# Altium schematic sheet IDD_measurement.SchDoc: IDD_measurement
size A3; DocumentNumber: MB1144; Revision: C-02; SheetNumber: 19; SheetTotal: 25; Project: STM32L476G-EVAL; ModifiedDate: 9/23/2015
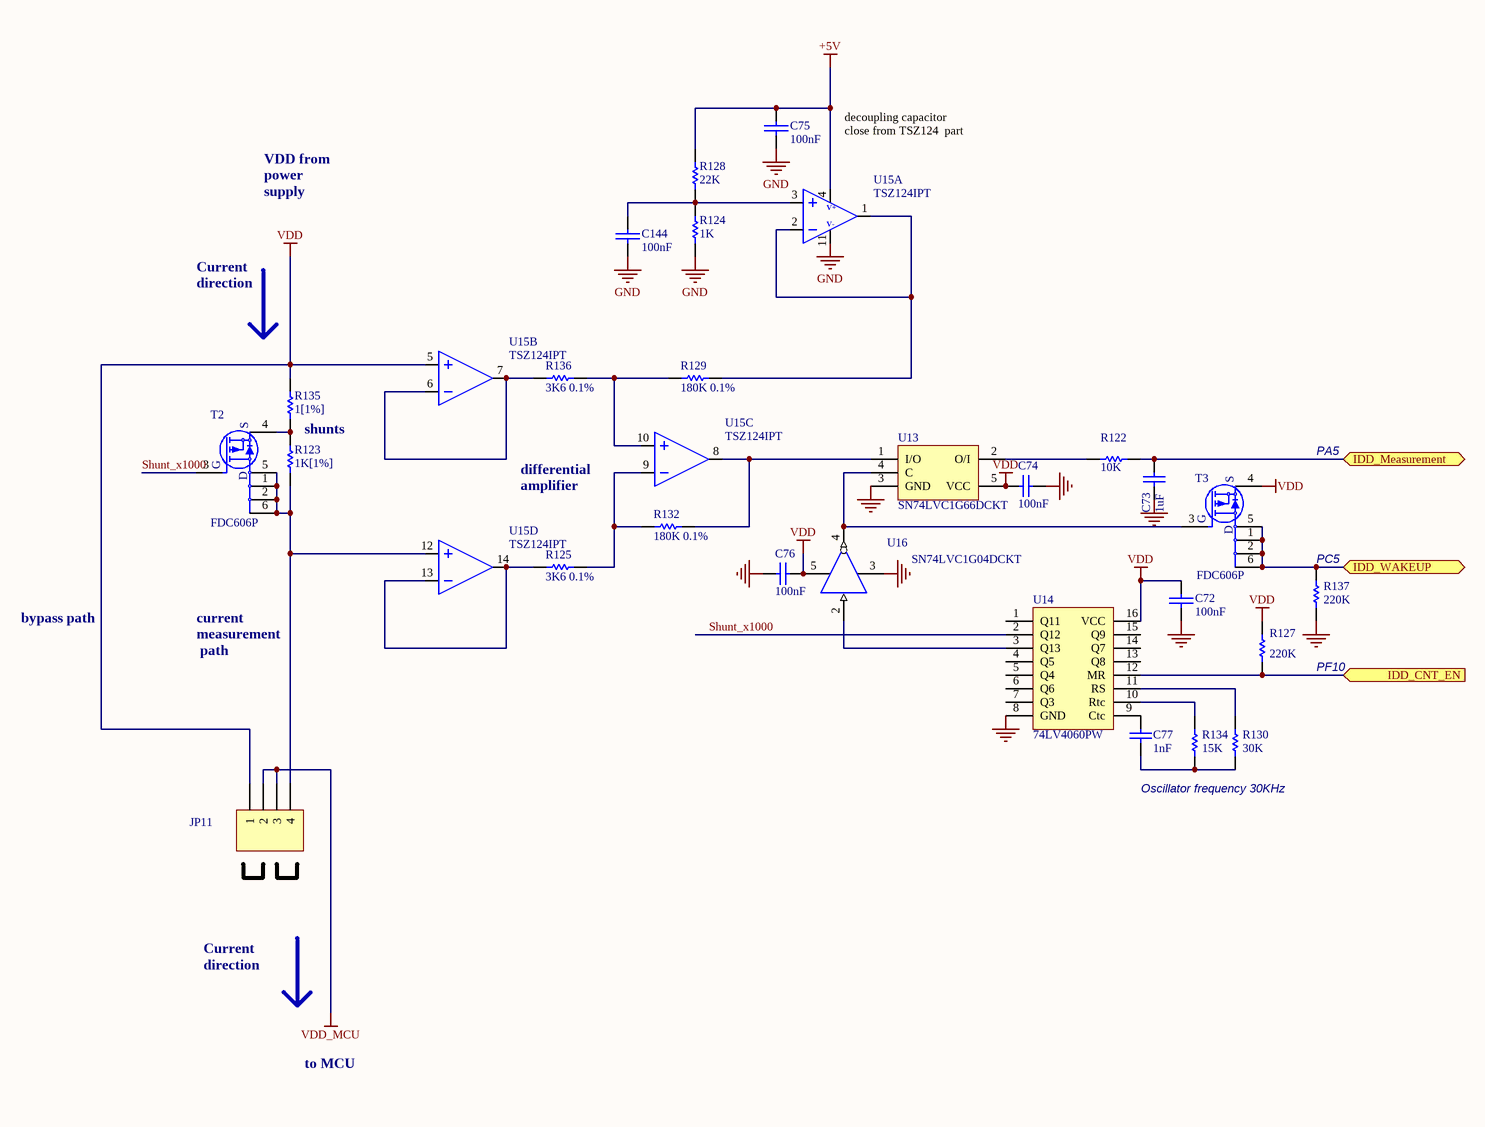
[diagram p0: IDD_measurement.SchDoc]

## Parts
C72  100nF  [0402C]
C73  1uF  [0603C]
C74  100nF  [0402C]
C75  100nF  [0402C]
C76  100nF  [0402C]
C77  1nF  [0402C]
C144  100nF  [0402C]
JP11  Header 4  [SIP4]  (value not drawn)
R122  10K  [0402R]
R123  1K[1%]  [0603R]
R124  1K  [0402R]
R125  3K6 0.1%  [0402R]
R127  220K  [0402R]
R128  22K  [0402R]
R129  180K 0.1%  [0402R]
R130  30K  [0402R]
R132  180K 0.1%  [0402R]
R134  15K  [0402R]
R135  1[1%]  [0603R]
R136  3K6 0.1%  [0402R]
R137  220K  [0402R]
T2  FDC606P  [SOT23-6]
T3  FDC606P  [SOT23-6]
U13  SN74LVC1G66DCKT  [SC70-5]
U14  74LV4060PW  [TSSOP16_0R65_5x6R4]
U15  TSZ124IPT  [TSSOP14_0R65_5X6R4]  (parts A,B,C,D of 4)
U16  SN74LVC1G04DCKT  [SC70-5]

## Ports
IDD_CNT_EN (in), IDD_Measurement, IDD_WAKEUP

## Nets
+5V: C75.1 R128.1 U15.4
GND: C72.2 C73.2 C74.1 C75.2 C76.2 C144.2 R124.2 R137.2 U13.3(GND) U14.8(GND) U15.11 U16.3(GND)
VDD: C72.1 C74.2 C76.1 JP11.1 R127.1 R135.2 T3.4(S) U13.5(VCC) U14.16(VCC) U15.5 U16.5(VCC)
VDD_MCU: JP11.2 JP11.3
IDD_CNT_EN: R127.2 U14.12(MR) ; port IDD_CNT_EN
IDD_Measurement: C73.1 R122.2 ; port IDD_Measurement
IDD_WAKEUP: R137.1 T3.1(D) T3.2(D) T3.5(D) T3.6(D) ; port IDD_WAKEUP
Shunt_x1000: T2.3(G) U14.2(Q12)
NetC77_1: C77.1 U14.9(Ctc)
NetC77_2: C77.2 R130.2 R134.2
NetC144_1: C144.1 R124.1 R128.2 U15.3
NetJP11_4: JP11.4 R123.1 T2.1(D) T2.2(D) T2.5(D) T2.6(D) U15.12
NetR122_1: R122.1 U13.2(O/I)
NetR123_2: R123.2 R135.1 T2.4(S)
NetR125_1: R125.1 U15.13 U15.14
NetR125_2: R125.2 R132.1 U15.9
NetR129_1: R129.1 R136.2 U15.10
NetR129_2: R129.2 U15.1 U15.2
NetR130_1: R130.1 U14.11(RS)
NetR132_2: R132.2 U13.1(I/O) U15.8
NetR134_1: R134.1 U14.10(Rtc)
NetR136_1: R136.1 U15.6 U15.7
NetT3_3: T3.3(G) U13.4(C) U16.4(1Y)
NetU14_3: U14.3(Q13) U16.2(1A)

Not connected (* = marked no-connect by the designer): U14 1(Q11) 4(Q5) 5(Q4) 6(Q6) 7(Q3) 13(Q8) 14(Q7) 15(Q9); U16 1(NC)

## Notes on the sheet
- decoupling capacitor
  close from TSZ124  part
- VDD from power supply
- Current direction
- shunts
- PA5
- differential
  amplifier
- (near R137) PC5
- bypass path
- current
  measurement
  path
- PF10
- Oscillator frequency 30KHz
- to MCU
- Title:
- Project:
- Size:
- Date:
- A3
- Reference:
- Sheet:
- Revision:
- of
- (in symbol AOP-14PINS, part A) V+; V-

## Library data of the parts
C72 C75 C144 = CAP: Ordered by: Subcon; ECCN_US/EU: NA
C73 = CAP: Capacitor; Value: 100nF; Ordered by: Subcon; ECCN_US/EU: NA; Published: 8-Jun-2000; Revision: July-2002: Re-released for DXP Platform.; Publisher: Altium Limited
C74 C76 = CAP: Capacitor; Value: 100pF; Ordered by: Subcon; ECCN_US/EU: NA; Published: 8-Jun-2000; Revision: July-2002: Re-released for DXP Platform.; Publisher: Altium Limited
C77 = Cap: Capacitor; Value: 10nF; Ordered by: Subcon; ECCN_US/EU: NA; Published: 8-Jun-2000; Revision: July-2002: Re-released for DXP Platform.; Publisher: Altium Limited
JP11 = Header 4: Header, 4-Pin; Ordered by: Subcon; Revision: 17-Jul-2002: Re-released for DXP Platform.; Publisher: Altium Limited; ECCN_US/EU: n/a
R122 R123 R125 R127-R130 R132 R134-R137 = res1: Resistor; Value: 1K; Ordered by: Subcon; ECCN_US/EU: NA; Published: 8-Jun-2000; Revision: July-2002: Re-released for DXP Platform.; Publisher: Altium Limited
R124 = res1: Resistor; Ordered by: Subcon; ECCN_US/EU: NA; Published: 8-Jun-2000; Revision: July-2002: Re-released for DXP Platform.; Publisher: Altium Limited; Value: 1K
T2 T3 = STT5PF20V: Manuf_1: Fairchild; Ordered by: Subcon; ECCN_US/EU: EAR99/NEC; Manuf_Part_1: FDC606P
U13 = 74H1G66STR: Manuf_1: TI; Ordered by: Subcon; ECCN_US/EU: EAR99/NEC; Manuf_Part_1: SN74LVC1G66DCKT
U14 = M74HC4060TTR: Manuf_1: NXP; Ordered by: Subcon; ECCN_US/EU: EAR99/NEC; Manuf_Part_1: 74LV4060PW
U15 = AOP-14PINS: Very high accuracy (5 µV) zero drift 5 V quad OpAmp; Ordered by: ST; ECCN_US/EU: EAR99/NEC; Ref St: 9177442; Order: TSZ124IPT; Manuf_1: ST; Manuf_Part_1: TSZ124IPT
U16 = 74LX1G04CTR: Manuf_1: TI; Ordered by: Subcon; ECCN_US/EU: EAR99/NEC; Manuf_Part_1: SN74LVC1G04DCKT